# Altium project 1st_desing.PrjPcb (part 1 of 2)
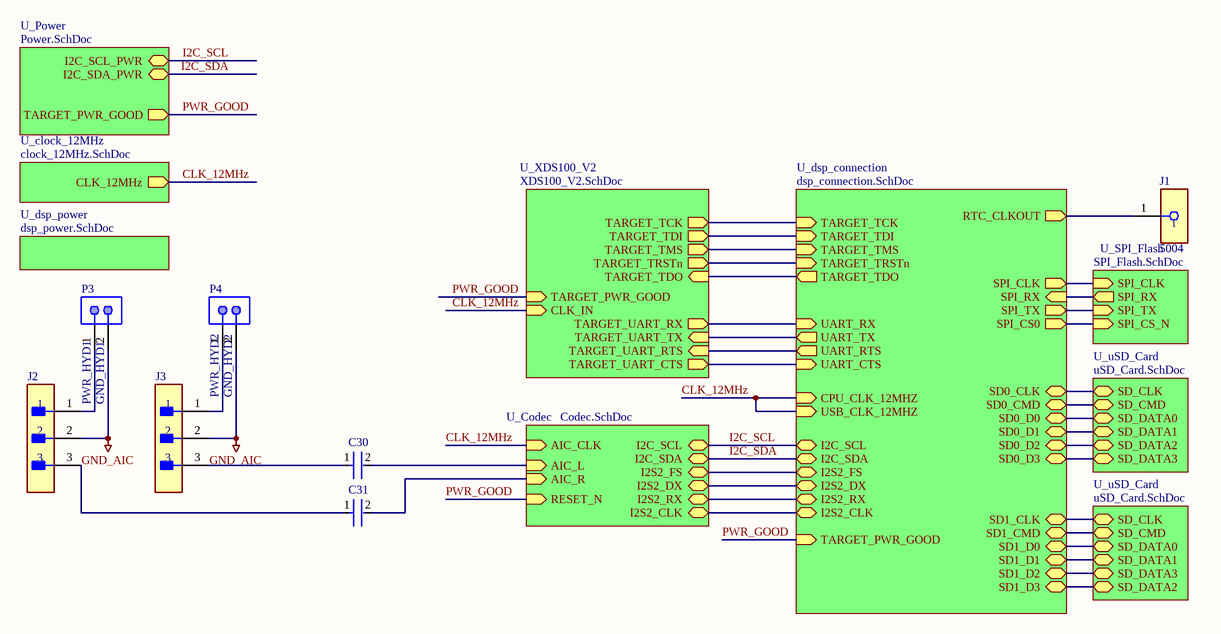
[diagram p0: SAMARUC.SchDoc]
9 sheets, 203 parts. Net scope: hierarchical (ports join the sheet entries above them; power ports are global).
Board file: PCB_SAMARUC.PcbDoc
Sheets:
  SAMARUC.SchDoc
    U_Codec = Codec.SchDoc
    U_SPI_Flash = SPI_Flash.SchDoc
    U_uSD_Card = uSD_Card.SchDoc
    U_clock_12MHz = clock_12MHz.SchDoc
    U_dsp_connection = dsp_connection.SchDoc
    U_XDS100_V2 = XDS100_V2.SchDoc
    U_dsp_power = dsp_power.SchDoc
    U_uSD_Card = uSD_Card.SchDoc
    U_Power = Power.SchDoc

## Sheet SAMARUC.SchDoc
size A4; SheetNumber: 1; SheetTotal: 9

### Parts
C30  RCER71H106MWK1H03B  [FP-RCEWM1-MFG]  (value not drawn)
C31  RCER71H106MWK1H03B  [FP-RCEWM1-MFG]  (value not drawn)
J1  5004  [FP-5004-MFG]
J2  22-11-2032  [FP-22-11-2032-MFG]  (value not drawn)
J3  22-11-2032  [FP-22-11-2032-MFG]  (value not drawn)
P3  22-23-2021  [MOLX-22-23-2021_V]  (value not drawn)
P4  22-23-2021  [MOLX-22-23-2021_V]  (value not drawn)

### Sub-sheets
U_clock_12MHz = clock_12MHz.SchDoc: CLK_12MHz (out)
U_Codec = Codec.SchDoc: I2C_SCL (bidir), I2C_SDA (bidir), I2S2_FS (bidir), I2S2_DX (bidir), I2S2_RX (bidir), I2S2_CLK (bidir), RESET_N (in), AIC_L (in), AIC_R (in), AIC_CLK (in)
U_dsp_connection = dsp_connection.SchDoc: TARGET_TCK (in), TARGET_TDI (in), TARGET_TDO (out), TARGET_TMS (in), TARGET_TRSTn (in), I2C_SCL (bidir), I2C_SDA (bidir), I2S2_FS (bidir), I2S2_DX (bidir), I2S2_RX (bidir), I2S2_CLK (bidir), USB_CLK_12MHZ (in), RTC_CLKOUT (out), CPU_CLK_12MHZ (in), SD0_D0 (bidir), SD1_D1 (bidir), UART_RX (in), UART_TX (out), SD0_D1 (bidir), UART_RTS (out), SD1_CMD (bidir), SD0_D3 (bidir), SD0_CMD (bidir), SPI_CLK (out), SD1_CLK (bidir), SD1_D0 (bidir), UART_CTS (in), SPI_TX (out), SD0_D2 (bidir), SPI_RX (in), SD1_D2 (bidir), SPI_CS0 (out), SD0_CLK (bidir), SD1_D3 (bidir), TARGET_PWR_GOOD (in)
U_dsp_power = dsp_power.SchDoc: no entries
U_Power = Power.SchDoc: TARGET_PWR_GOOD (out), I2C_SCL_PWR (bidir), I2C_SDA_PWR (bidir)
U_SPI_Flash = SPI_Flash.SchDoc: SPI_CLK (in), SPI_TX (in), SPI_CS_N (in), SPI_RX (out)
U_uSD_Card = uSD_Card.SchDoc: SD_DATA2 (bidir), SD_DATA3 (bidir), SD_CMD (bidir), SD_CLK (bidir), SD_DATA0 (bidir), SD_DATA1 (bidir)
U_uSD_Card = uSD_Card.SchDoc: SD_DATA2 (bidir), SD_DATA3 (bidir), SD_CMD (bidir), SD_CLK (bidir), SD_DATA0 (bidir), SD_DATA1 (bidir)
U_XDS100_V2 = XDS100_V2.SchDoc: CLK_IN (in), TARGET_TCK (out), TARGET_TDI (out), TARGET_TDO (in), TARGET_TMS (out), TARGET_TRSTn (out), TARGET_PWR_GOOD (in), TARGET_UART_TX (in), TARGET_UART_RX (out), TARGET_UART_CTS (out), TARGET_UART_RTS (in)

### Nets
GND_AIC: J2.2 J3.2 P3.2 P4.2
CLK_12MHz: sheet U_Codec/AIC_CLK, sheet U_clock_12MHz/CLK_12MHz, sheet U_dsp_connection/USB_CLK_12MHZ, sheet U_dsp_connection/CPU_CLK_12MHZ, sheet U_XDS100_V2/CLK_IN
I2C_SCL: sheet U_Codec/I2C_SCL, sheet U_dsp_connection/I2C_SCL, sheet U_Power/I2C_SCL_PWR
I2C_SDA: sheet U_Codec/I2C_SDA, sheet U_dsp_connection/I2C_SDA, sheet U_Power/I2C_SDA_PWR
PWR_GOOD: sheet U_Codec/RESET_N, sheet U_dsp_connection/TARGET_PWR_GOOD, sheet U_XDS100_V2/TARGET_PWR_GOOD, sheet U_Power/TARGET_PWR_GOOD
NetC5_2: C30.2 ; sheet U_Codec/AIC_L
NetC6_2: C31.2 ; sheet U_Codec/AIC_R
NetC30_1: C30.1 J3.3
NetC31_1: C31.1 J2.3
NetIC1_A3: J1.1 ; sheet U_dsp_connection/RTC_CLKOUT
NetIC1_J1: sheet U_dsp_connection/SD0_D0, sheet U_uSD_Card/SD_DATA0
NetIC1_K1: sheet U_SPI_Flash/SPI_TX, sheet U_dsp_connection/SPI_TX
NetIC1_K2: sheet U_dsp_connection/TARGET_TDI, sheet U_XDS100_V2/TARGET_TDI
NetIC1_L1: sheet U_SPI_Flash/SPI_CS_N, sheet U_dsp_connection/SPI_CS0
NetIC1_L3: sheet U_SPI_Flash/SPI_CLK, sheet U_dsp_connection/SPI_CLK
NetIC1_L11: sheet U_uSD_Card/SD_CMD, sheet U_dsp_connection/SD1_CMD
NetIC1_L12: sheet U_uSD_Card/SD_DATA3, sheet U_dsp_connection/SD1_D2
NetIC1_M8: sheet U_dsp_connection/SD0_CLK, sheet U_uSD_Card/SD_CLK
NetIC1_M10: sheet U_dsp_connection/SD0_CMD, sheet U_uSD_Card/SD_CMD
NetIC1_M11: sheet U_dsp_connection/UART_TX, sheet U_XDS100_V2/TARGET_UART_TX
NetIC1_M12: sheet U_uSD_Card/SD_DATA2, sheet U_dsp_connection/SD1_D3
NetIC1_M13: sheet U_uSD_Card/SD_DATA0, sheet U_dsp_connection/SD1_D0
NetIC1_M14: sheet U_uSD_Card/SD_CLK, sheet U_dsp_connection/SD1_CLK
NetIC1_N1: sheet U_dsp_connection/TARGET_TDO, sheet U_XDS100_V2/TARGET_TDO
NetIC1_N3: sheet U_dsp_connection/TARGET_TCK, sheet U_XDS100_V2/TARGET_TCK
NetIC1_N4: sheet U_SPI_Flash/SPI_RX, sheet U_dsp_connection/SPI_RX
NetIC1_N6: sheet U_dsp_connection/TARGET_TMS, sheet U_XDS100_V2/TARGET_TMS
NetIC1_N10: sheet U_Codec/I2S2_FS, sheet U_dsp_connection/I2S2_FS
NetIC1_N12: sheet U_dsp_connection/UART_RTS, sheet U_XDS100_V2/TARGET_UART_RTS
NetIC1_N13: sheet U_dsp_connection/SD0_D2, sheet U_uSD_Card/SD_DATA2
NetIC1_P4: sheet U_dsp_connection/TARGET_TRSTn, sheet U_XDS100_V2/TARGET_TRSTn
NetIC1_P5: sheet U_Codec/I2S2_CLK, sheet U_dsp_connection/I2S2_CLK
NetIC1_P6: sheet U_dsp_connection/SD0_D1, sheet U_uSD_Card/SD_DATA1
NetIC1_P7: sheet U_dsp_connection/SD0_D3, sheet U_uSD_Card/SD_DATA3
NetIC1_P9: sheet U_Codec/I2S2_RX, sheet U_dsp_connection/I2S2_RX
NetIC1_P10: sheet U_uSD_Card/SD_DATA1, sheet U_dsp_connection/SD1_D1
NetIC1_P11: sheet U_Codec/I2S2_DX, sheet U_dsp_connection/I2S2_DX
NetIC1_P12: sheet U_dsp_connection/UART_CTS, sheet U_XDS100_V2/TARGET_UART_CTS
NetIC1_P13: sheet U_dsp_connection/UART_RX, sheet U_XDS100_V2/TARGET_UART_RX
NetJ2_1: J2.1 P3.1
NetJ3_1: J3.1 P4.1

### Notes on the sheet
- PWR_HYD1
- GND_HYD1
- PWR_HYD2
- (near P4) GND_HYD2

### Library data of the parts
C30 C31 = CMP-06035-035073-1: Cap Ceramic 10uF 50V X7R ±20% Radial 5mm +125°C Automotive Ammo Pack; Lead/Base Style: Formed Leads; Lead Diameter: 0.5mm; Width: 4mm; Max Operating Temperature: 125°C; Case/Package: Radial; Capacitance: 10uF; Mount: Through Hole; Depth: 7.5mm; Dielectric: X7R; Tolerance: 20%; Length: 5.5mm; Min Operating Temperature: -55°C; Height: 7.5mm; Ratings: AEC-Q200; Voltage Rating: 50V; Lead Pitch: 0.197inch; Diameter: 5.5mm; Height - Seated (Max): 0.295inch; Voltage: 50V; Resistor Type: Ceramic; Voltage Rating (DC): 50V; Package Quantity: 500; Lead Free: Lead Free; Packaging: Bulk; Termination: Radial
J1 = CMP-2000-05575-2: PC TEST POINT MINIATURE YELLOW; Manufacturer: Keystone; Number Of Contacts: 1; Is Female: yes; Device Class L1: Connectors; Manufacturer Part Number: 5004; Digikey Description: PC TEST POINT MINIATURE YELLOW; ComponentLink2URL: https://www.keyelco.com/product-pdf.cfm?p=1313; Lead Free: Yes; ComponentLink2Description: Datasheet; Category: Conn; Height: 4.72mm; Octopart: https://octopart.com/5004-keystone-28591; Mouser Description: TEST POINT PC MINI .040"D YELLOW; Device Class L3: unset; Contact Material: Silver; Package: 5004; Automotive: No; Device Class L2: unset; RoHS: TRUE
J2 J3 = CMP-04776-000113-1: CONN HEADER VERT 3POS 2.54MM; Manufacturer: Molex; Number Of Contacts: 3; Voltage Rating: 500V; Conn Gender: Male; Current Rating: 4A; Conn Orientation: Vertical; Device Class L2: Headers and Wire Housings; Number Of Rows: 1; Temperature Range High: +80°C; RoHS: TRUE; ComponentLink2URL: https://www.molex.com/webdocs/datasheets/pdf/en-us/0022112032_PCB_HEADERS.pdf; Manufacturer Part Number: 22-11-2032; Device Class L3: unset; Automotive: No; Temperature: -40°C to +80°C; Temperature Range Low: -40°C; Lead Free: Yes; Pitch: 2.54mm; Footprint Url: https://www.molex.com/pdm_docs/sd/022112032_sd.pdf; Digikey Description: CONN HEADER VERT 3POS 2.54MM; Contact Material: Gold,Nickel; Octopart: https://octopart.com/22-11-2032-molex-10085; Height: 10.91mm; Mouser Description: KK® 254 Solid Header, Vertical, with Friction Lock, 3 Circuits, Gold (Au) Plating; Package: 22-11-2032; Device Class L1: Connectors; Mounting Type: Through Hole; ComponentLink2Description: Datasheet; Category: Conn
P3 P4 = CMP-1704-00001-3: Male Header, Pitch 2.54 mm, 1 x 2 Position, Height 10.67 mm, Tail Length 3.56 mm, 0 to 75 degC, RoHS, Bulk; Package Quantity: 3000; Height: 10.67 mm; RoHSCompliant: True; ComponentLink2URL: https://datasheet.ciiva.com/19454/232266-19454304.pdf; PartNumber: 22-23-2021; Packaging: Bulk; ComponentLink2Description: Datasheet; Min Operating Temperature: 0 degC; ComponentLink1Description: Manufacturer URL; Length: 5.08 mm; Mounting Technology: Through Hole; Max Operating Temperature: 75 degC; REACH SVHC: Unknown; PackageDescription: Male Header, Pitch 2.54 mm, 1 x 2 Position, Height 10.67 mm, Tail Length 3.56 mm; ComponentLink1URL: http://www.molex.com/; Mount: Through Hole; Radiation Hardening: No; Width: 6.35 mm; Pins: 2

## Sheet Codec.SchDoc
size A4; SheetNumber: 2; SheetTotal: 9
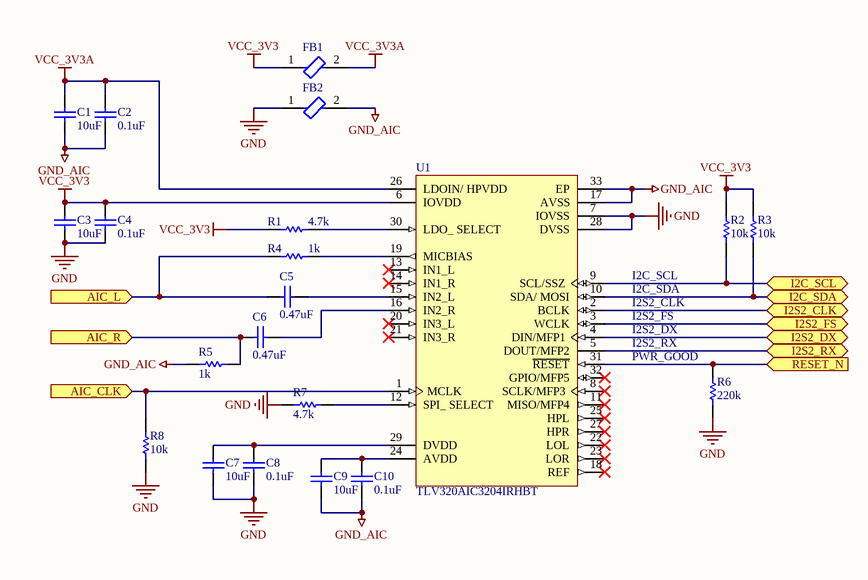
[diagram p1: Codec.SchDoc]

### Parts
C1  10uF  [0805_C_S]
C2  0.1uF  [0805_C_S]
C3  10uF  [0805_C_S]
C4  0.1uF  [0805_C_S]
C5  0.47uF  [0805_C_S]
C6  0.47uF  [0805_C_S]
C7  10uF  [0805_C_S]
C8  0.1uF  [0805_C_S]
C9  10uF  [0805_C_S]
C10  0.1uF  [0805_C_S]
FB1  BLM21AG151SN1D  [FP-BLM21-0_2-t0_85-e0_5-MFG]  (value not drawn)
FB2  BLM21AG151SN1D  [FP-BLM21-0_2-t0_85-e0_5-MFG]  (value not drawn)
R1  4.7k  [0805_R_S]
R2  10k  [0805_R_S]
R3  10k  [0805_R_S]
R4  1k  [0805_R_S]
R5  1k  [0805_R_S]
R6  220k  [0805_R_S]
R7  4.7k  [0805_R_S]
R8  10k  [0805_R_S]
U1  TLV320AIC3204IRHBT  [RHB0032E_V]

### Ports
AIC_CLK (in), AIC_L (in), AIC_R (in), I2C_SCL (bidir), I2C_SDA (bidir), I2S2_CLK (bidir), I2S2_DX (bidir), I2S2_FS (bidir), I2S2_RX (bidir), RESET_N (in)

### Nets
GND: C3.1 C4.1 C7.1 C8.1 FB2.1 R6.1 R7.1 R8.1 U1.7(IOVSS) U1.28(DVSS)
GND_AIC: C1.1 C2.1 C9.1 C10.1 FB2.2 R5.2 U1.17(AVSS) U1.33(EP)
VCC_3V3: C3.2 C4.2 FB1.1 R1.2 R2.2 R3.2 U1.6(IOVDD)
VCC_3V3A: C1.2 C2.2 FB1.2 U1.26(LDOIN/_HPVDD)
CLK_12MHz: R8.2 U1.1(MCLK) ; port AIC_CLK
I2C_SCL: R2.1 U1.9(SCL/SSZ) ; port I2C_SCL
I2C_SDA: R3.1 U1.10(SDA/_MOSI) ; port I2C_SDA
PWR_GOOD: R6.2 U1.31(~{RESET}) ; port RESET_N
NetC5_1: C5.1 U1.15(IN2_L)
NetC5_2: C5.2 R4.2 ; port AIC_L
NetC6_1: C6.1 U1.16(IN2_R)
NetC6_2: C6.2 R5.1 ; port AIC_R
NetC7_2: C7.2 C8.2 U1.29(DVDD)
NetC9_2: C9.2 C10.2 U1.24(AVDD)
NetIC1_N10: U1.3(WCLK) ; port I2S2_FS
NetIC1_P5: U1.2(BCLK) ; port I2S2_CLK
NetIC1_P9: U1.5(DOUT/MFP2) ; port I2S2_RX
NetIC1_P11: U1.4(DIN/MFP1) ; port I2S2_DX
NetR1_1: R1.1 U1.30(LDO__SELECT)
NetR4_1: R4.1 U1.19(MICBIAS)
NetR7_2: R7.2 U1.12(SPI__SELECT)

Not connected (* = marked no-connect by the designer): U1 8(SCLK/MFP3)* 11(MISO/MFP4)* 13(IN1_L)* 14(IN1_R)* 18(REF)* 20(IN3_L)* 21(IN3_R)* 22(LOL)* 23(LOR)* 25(HPL)* 27(HPR)* 32(GPIO/MFP5)*

### Notes on the sheet
- I2C_SCL
- I2C_SDA
- I2S2_CLK
- I2S2_FS
- PWR_GOOD
- I2S2_DX
- I2S2_RX

### Library data of the parts
C1-C10 = Cap: Capacitor; Published: 8-Jun-2000; LatestRevisionDate: 17-Jul-2002; LatestRevisionNote: Re-released for DXP Platform.; Publisher: Altium Limited
  C1 C3 C7 C9: Value: 10uF
  C2 C4 C8 C10: Value: 0.1uF
  C5 C6: Value: 0.47uF
FB1 FB2 = CMP-0686-00717-3: Chip Ferrite Bead, 0805, 150Ω @ 100MHz, 0.09Ω, 25%, 1A; Number of Circuits: 1; Max Current Rating: 800mA; DC Resistance (DCR): 100mR; Shielding: Unshielded; DC Current: 200mA; Impedance: 150R; Contact Plating: Tin; Weight: 0.000194oz; Series: EMIFIL®, BLM21A; Core Material: Ferrite; Test Frequency: 100MHz; Case Code (Metric): 2012; Package Quantity: 4000; Lead Free: Lead Free; Max Operating Temperature: 125°C; Case Code (Imperial): 0805; Material: Ferrite; Min Operating Temperature: -55°C; Tolerance: 25%; Length: 2mm; DC Resistance-Max: 100mR; Width: 1.25mm; RoHS Compliant: Yes; Packaging: Tape and Reel; REACH SVHC: No SVHC; Depth: 1.45mm; Number of Pins: 2; Radiation Hardening: No; Current Rating: 800mA; Height: 0.85mm; Termination: SMD/SMT; Number of Lines: 1; Max DC Current: 200mA; Case/Package: 0805
R1-R8 = Res1: Resistor; Published: 8-Jun-2000; LatestRevisionDate: 17-Jul-2002; LatestRevisionNote: Re-released for DXP Platform.; Publisher: Altium Limited
  R1 R7: Value: 4.7k
  R2 R3 R8: Value: 10k
  R4 R5: Value: 1k
  R6: Value: 220k
U1 = CMP-0331-00080-2: Very Low-Power Stereo Audio CODEC with Power Tune? Technology, 2 ADCs and 2 DACs, 100 dB DAC SNR, -40 to 85 degC, 32-pin QFN (RHB), Green (RoHS & no Sb/Br); Manufacturer: Texas Instruments; Digital Audio Interfaces: L, R, I2S, TDM, DSP; Sampling Rate (Max) (kHz): 192; DAC SNR: 100; # DACs: 2; Battery Powered: TRUE; Additional Features: PowerTune (tm), Processing blocks for digital audio effects, LP Bypass, PLL, Digital Mic Support, LDO; Control Interface: SPI, I2C; PartNumber: TLV320AIC3204IRHBT; Mounting Technology: Surface Mount; DatasheetVersion: SLOS602A; ComponentLink1URL: http://www.ti.com/general/docs/lit/getliterature.tsp?genericPartNumber=TLV320AIC3204&fileType=pdf; PackageDescription: 32-Pin Plastic Quad Flat No-Lead, 5 x 5 mm Body, 0.5 mm Pitch, 3.45 x 3.45 mm Exposed Pad; PackageReference: RHB0032E; PackageVersion: revD, Jun-2011; ComponentLink1Description: Datasheet; Code_JEDEC: MO-220; # ADCs (typ): 2

## Sheet SPI_Flash.SchDoc
size A4; SheetNumber: 3; SheetTotal: 10
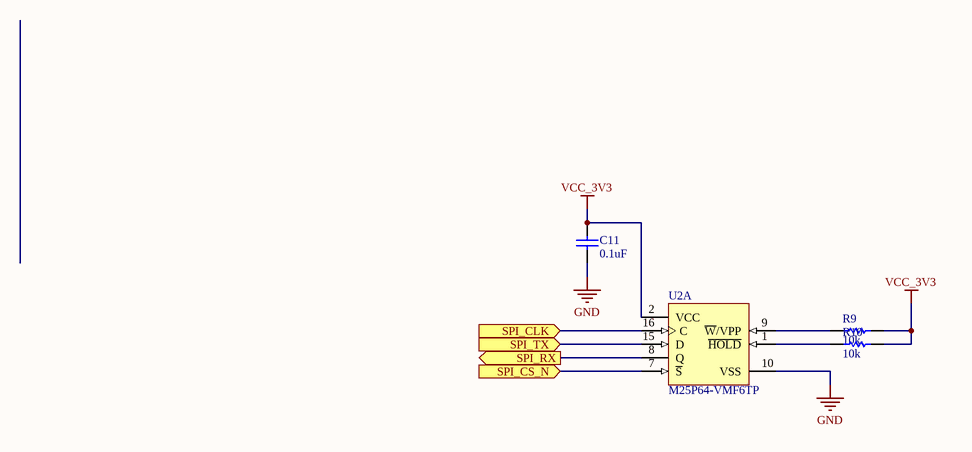
[diagram p2: SPI_Flash.SchDoc]

### Parts
C11  0.1uF  [0805_C_S]
R9  10k  [0805_R_S]
R10  10k  [0805_R_S]
U2  M25P64-VMF6TP  [MICT-MF-16_N]  (part A of 2)

### Ports
SPI_CLK (in), SPI_CS_N (in), SPI_RX (out), SPI_TX (in)

### Nets
GND: C11.1 U2.10(VSS)
VCC_3V3: C11.2 R9.1 R10.1 U2.2(VCC)
NetIC1_K1: U2.15(D) ; port SPI_TX
NetIC1_L1: U2.7(~{S}) ; port SPI_CS_N
NetIC1_L3: U2.16(C) ; port SPI_CLK
NetIC1_N4: U2.8(Q) ; port SPI_RX
NetR9_2: R9.2 U2.9(~{W}/VPP)
NetR10_2: R10.2 U2.1(~{HOLD})

### Library data of the parts
C11 = Cap: Capacitor; Published: 8-Jun-2000; LatestRevisionDate: 17-Jul-2002; LatestRevisionNote: Re-released for DXP Platform.; Publisher: Altium Limited; Value: 0.1uF
R9 R10 = Res1: Resistor; Published: 8-Jun-2000; LatestRevisionDate: 17-Jul-2002; LatestRevisionNote: Re-released for DXP Platform.; Publisher: Altium Limited; Value: 10k
U2 = CMP-0357-00029-1: 64 Mb (x1) Serial NOR Flash Memory, 75 MHz, 2.7 to 3.6 V, 16-pin SO16 Wide (MF), Tape & Reel; Manufacturer: Micron; Part Family: M25PÂ; Density: 64MbÂ; Speed: 75 MHzÂ; Voltage: 2.7V-3.6VÂ; PackageVersion: Rev. A; ComponentLink1Description: Manufacturer URL; PartNumber: M25P64-VMF6TP; Package: SO16 WideÂ; Applications: EmbeddedÂ; PackageDescription: 16-Pin SO Wide, 7.5 X 10.3 mm, Pitch 1.27 mm; ComponentLink1URL: http://www.micron.com/; Mounting Technology: Surface Mount; Part Status: ProductionÂ; Width: x1Â; ComponentLink3Description: Package Specification; DatasheetVersion: Rev. 12; Type: Data StorageÂ; ComponentLink3URL: http://www.micron.com/~/media/Documents/Products/Data%20Sheet/NOR%20Flash/Serial%20NOR/M25P/M25P128.pdf; RoHS: YesÂ; ComponentLink2URL: http://www.micron.com/~/media/Documents/Products/Data%20Sheet/NOR%20Flash/Serial%20NOR/M25P/M25P64.pdf; PackageReference: MICT-MF-16; ComponentLink2Description: Datasheet

## Sheet uSD_Card.SchDoc
size A4; SheetNumber: 4; SheetTotal: 10
Used 2 times, as channels U_uSD_Card, U_uSD_Card. Parts and nets are listed once, with the designators drawn on the sheet.
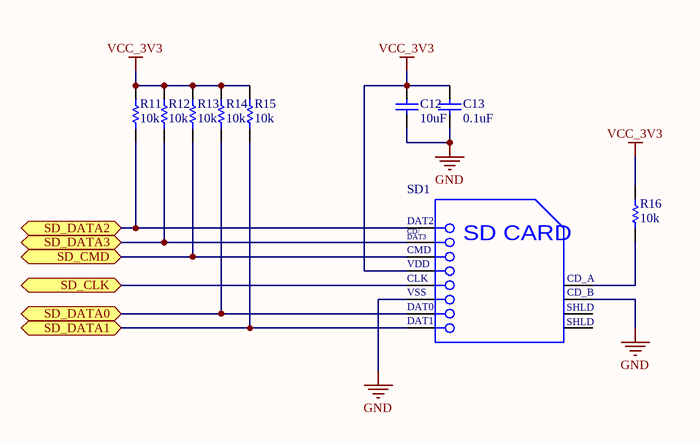
[diagram p3: uSD_Card.SchDoc]

### Parts
C12  10uF  [0805_C_S]
C13  0.1uF  [0805_C_S]
R11  10k  [0805_R_S]
R12  10k  [0805_R_S]
R13  10k  [0805_R_S]
R14  10k  [0805_R_S]
R15  10k  [0805_R_S]
R16  10k  [0805_R_S]
SD1  104031-0811  [MOLX-104031-0811_V]  (value not drawn)

### Ports
SD_CLK (bidir), SD_CMD (bidir), SD_DATA0 (bidir), SD_DATA1 (bidir), SD_DATA2 (bidir), SD_DATA3 (bidir)

### Nets
GND: C12.1 C13.1 SD1.6(VSS2) SD1.10(CD_B)
VCC_3V3: C12.2 C13.2 R11.1 R12.1 R13.1 R14.1 R15.1 R16.1 SD1.4(VDD)
SD_CLK: SD1.5(CLK) ; port SD_CLK
SD_CMD: R13.2 SD1.3(VSS1) ; port SD_CMD
SD_DATA0: R14.2 SD1.7(DAT0) ; port SD_DATA0
SD_DATA1: R15.2 SD1.8(DAT1) ; port SD_DATA1
SD_DATA2: R11.2 SD1.1(CD/DAT3) ; port SD_DATA2
SD_DATA3: R12.2 SD1.2(CMD) ; port SD_DATA3
NetR16_2: R16.2 SD1.9(CD_A)

Not connected (* = marked no-connect by the designer): SD1 11(SHLD1) 12(SHLD2)

### Channels
U_uSD_Card: designators end in _U_uSD_Card#1; ports SD_CLK=NetIC1_M14 SD_CMD=NetIC1_L11 SD_DATA0=NetIC1_M13 SD_DATA1=NetIC1_P10 SD_DATA2=NetIC1_M12 SD_DATA3=NetIC1_L12
U_uSD_Card: designators end in _U_uSD_Card#2; ports SD_CLK=NetIC1_M8 SD_CMD=NetIC1_M10 SD_DATA0=NetIC1_J1 SD_DATA1=NetIC1_P6 SD_DATA2=NetIC1_N13 SD_DATA3=NetIC1_P7

### Notes on the sheet
- (in symbol CMP-2000-05825-1) DAT2; CD/; DAT3; SD CARD; VSS; SHLD

### Library data of the parts
C12 C13 = Cap: Capacitor; Published: 8-Jun-2000; LatestRevisionDate: 17-Jul-2002; LatestRevisionNote: Re-released for DXP Platform.; Publisher: Altium Limited
  C12: Value: 10uF
  C13: Value: 0.1uF
R11-R16 = Res1: Resistor; Published: 8-Jun-2000; LatestRevisionDate: 17-Jul-2002; LatestRevisionNote: Re-released for DXP Platform.; Publisher: Altium Limited; Value: 10k
SD1 = CMP-2000-05825-1: Micro SD Card, RA, -25 to 85 degC, 8-Pin SMD, RoHS, Tape and Reel; Voltage Rating: 10VAC/DC; Number of Contacts: 8; Insertion - Extraction Style: Push-Pull; Pitch: 1.1mm; Mating Cycles: 10000; Brand: Molex; Current Rating: 500mA; Manufacturer URL: http://www.molex.com/; Card Type: microSD; Mounting Type: Standard; Height: 1.42mm; Mounting Technology: SurfaceMount; Contact Plating: Gold; Product Category: MemoryCardConnectors; Package Description: 8-Pin Surface Mount Device, Body 11.95 x 11.4 mm, Pitch 1.1 mm; Datasheet URL: http://www.molex.com/pdm_docs/sd/1040310811_sd.pdf; Termination Style: SMD; Length: 11.4mm; Housing Material: LiquidCrystalPolymer(LCP); Orientation: RightAngle; RoHS: True; Contact Material: PhosphorBronze; Datasheet Version: Rev. E, 04/2006; Packaging: Reel; Manufacturer: Molex; Series: 104031; Product: CardConnectors; Number of Rows: 1Row; Package Reference: 104031-0811

## Sheet clock_12MHz.SchDoc
size A4; SheetNumber: 8; SheetTotal: 10
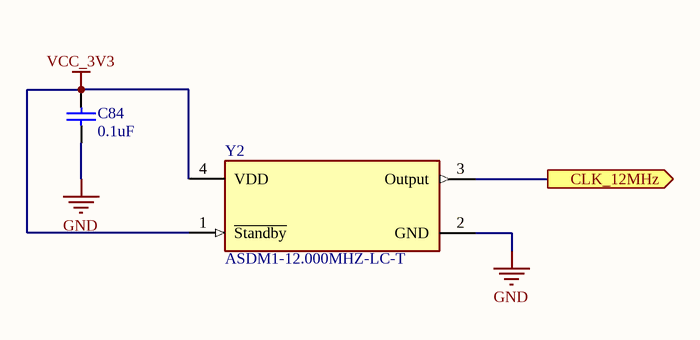
[diagram p4: clock_12MHz.SchDoc]

### Parts
C84  0.1uF  [0805_C_S]
Y2  ASDM1-12.000MHZ-LC-T  [FP-ASDM-ASDMB-MFG]

### Ports
CLK_12MHz (out)

### Nets
GND: C84.1 Y2.2(GND)
VCC_3V3: C84.2 Y2.1(~{Standby}) Y2.4(VDD)
CLK_12MHz: Y2.3(Output) ; port CLK_12MHz

### Library data of the parts
C84 = Cap: Capacitor; Published: 8-Jun-2000; LatestRevisionDate: 17-Jul-2002; LatestRevisionNote: Re-released for DXP Platform.; Publisher: Altium Limited; Value: 0.1uF
Y2 = CMP-27762-002611-1: MEMS Oscillator 12MHz ±50ppm LVCMOS 3.3V SMD 2.5x2mm; Load Capacitance: 15pF; Min Supply Voltage: 3V; Max Supply Voltage: 3.6V; Max Supply Current: 10mA; Length: 0.098inch; Operating Supply Voltage: 3.3V; Number of Pins: 4; Packaging: Tape and Reel; Height: 0.035inch; Width: 0.079inch; Mount: Surface Mount; Case/Package: SMD/SMT; Series: Pure Silicon™ ASDM; Lead Free: Lead Free; Frequency: 12MHz; Max Operating Temperature: 85°C; RoHS Compliant: Yes; Package Quantity: 1000; Min Operating Temperature: -40°C; Operating Frequency: 12 MHz; Termination: SMD/SMT; Frequency Stability: 50ppm

## Sheet dsp_connection.SchDoc
size A4; SheetNumber: 6; SheetTotal: 9
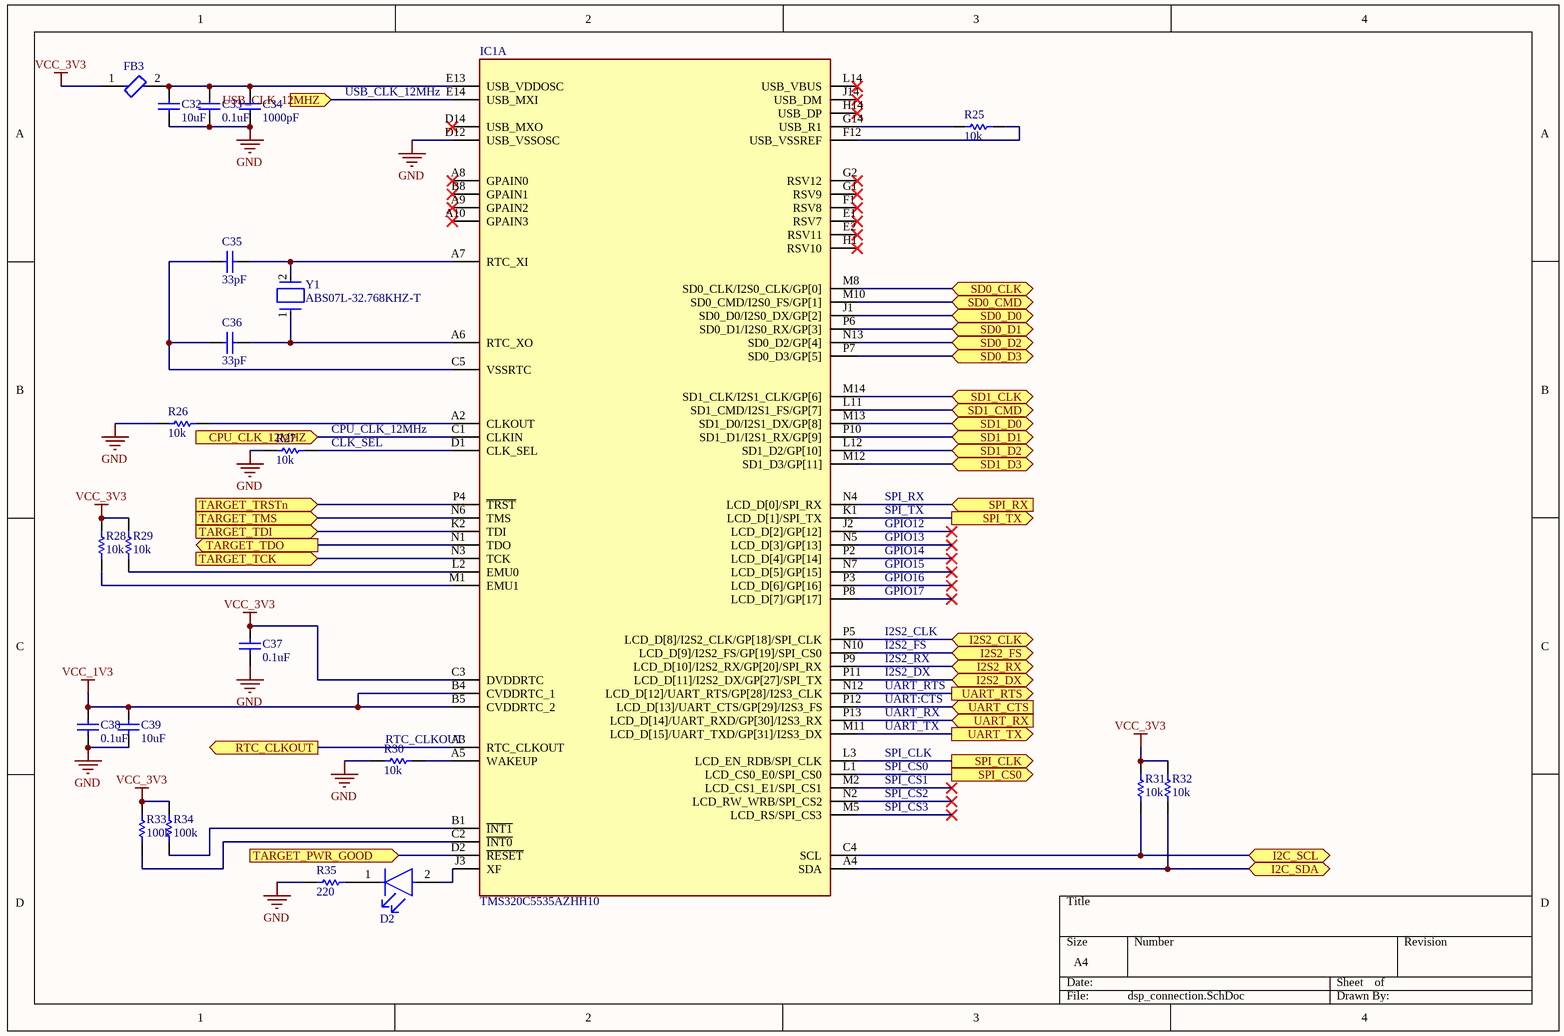
[diagram p5: dsp_connection.SchDoc]

### Parts
C32  10uF  [0805_C_S]
C33  0.1uF  [0805_C_S]
C34  1000pF  [0805_C_S]
C35  33pF  [0805_C_S]
C36  33pF  [0805_C_S]
C37  0.1uF  [0805_C_S]
C38  0.1uF  [0805_C_S]
C39  10uF  [0805_C_S]
D2  LTST-C150AKT  [FP-LTST-C150AKT-MFG]  (value not drawn)
FB3  BLM21AG151SN1D  [FP-BLM21-0_2-t0_85-e0_5-MFG]  (value not drawn)
IC1  TMS320C5535AZHH10  [BGA144C80P14X14_1200X1200X140]  (part A of 2)
R25  10k  [0805_R_S]
R26  10k  [0805_R_S]
R27  10k  [0805_R_S]
R28  10k  [0805_R_S]
R29  10k  [0805_R_S]
R30  10k  [0805_R_S]
R31  10k  [0805_R_S]
R32  10k  [0805_R_S]
R33  100k  [0805_R_S]
R34  100k  [0805_R_S]
R35  220  [0805_R_S]
Y1  ABS07L-32.768KHZ-T  [FP-ABS07L-MFG]

### Ports
CPU_CLK_12MHZ (in), I2C_SCL (bidir), I2C_SDA (bidir), I2S2_CLK (bidir), I2S2_DX (bidir), I2S2_FS (bidir), I2S2_RX (bidir), RTC_CLKOUT (out), SD0_CLK (bidir), SD0_CMD (bidir), SD0_D0 (bidir), SD0_D1 (bidir), SD0_D2 (bidir), SD0_D3 (bidir), SD1_CLK (bidir), SD1_CMD (bidir), SD1_D0 (bidir), SD1_D1 (bidir), SD1_D2 (bidir), SD1_D3 (bidir), SPI_CLK (out), SPI_CS0 (out), SPI_RX (in), SPI_TX (out), TARGET_PWR_GOOD (in), TARGET_TCK (in), TARGET_TDI (in), TARGET_TDO (out), TARGET_TMS (in), TARGET_TRSTn (in), UART_CTS (in), UART_RTS (out), UART_RX (in), UART_TX (out), USB_CLK_12MHZ (in)

### Nets
GND: C32.1 C33.1 C34.1 C37.1 C38.1 C39.1 IC1.D12(USB_VSSOSC) R26.1 R27.1 R30.1 R35.2
VCC_1V3: C38.2 C39.2 IC1.B4(CVDDRTC_1) IC1.B5(CVDDRTC_2)
VCC_3V3: C37.2 FB3.1 IC1.C3(DVDDRTC) R28.1 R29.1 R31.1 R32.1 R33.1 R34.1
CLK_12MHz: IC1.C1(CLKIN) IC1.E14(USB_MXI) ; port CPU_CLK_12MHZ, port USB_CLK_12MHZ
I2C_SCL: IC1.C4(SCL) R31.2 ; port I2C_SCL
I2C_SDA: IC1.A4(SDA) R32.2 ; port I2C_SDA
PWR_GOOD: IC1.D2(~{RESET}) ; port TARGET_PWR_GOOD
NetC32_2: C32.2 C33.2 C34.2 FB3.2 IC1.E13(USB_VDDOSC)
NetC35_1: C35.1 C36.1 IC1.C5(VSSRTC)
NetC35_2: C35.2 IC1.A7(RTC_XI) Y1.2
NetC36_2: C36.2 IC1.A6(RTC_XO) Y1.1
NetD2_1: D2.1(C) R35.1
NetD2_2: D2.2(A) IC1.J3(XF)
NetIC1_A2: IC1.A2(CLKOUT) R26.2
NetIC1_A3: IC1.A3(RTC_CLKOUT) ; port RTC_CLKOUT
NetIC1_A5: IC1.A5(WAKEUP) R30.2
NetIC1_B1: IC1.B1(~{INT1}) R34.2
NetIC1_C2: IC1.C2(~{INT0}) R33.2
NetIC1_D1: IC1.D1(CLK_SEL) R27.2
NetIC1_F12: IC1.F12(USB_VSSREF) R25.2
NetIC1_G14: IC1.G14(USB_R1) R25.1
NetIC1_J1: IC1.J1(SD0_D0/I2S0_DX/GP[2]) ; port SD0_D0
NetIC1_K1: IC1.K1(LCD_D[1]/SPI_TX) ; port SPI_TX
NetIC1_K2: IC1.K2(TDI) ; port TARGET_TDI
NetIC1_L1: IC1.L1(LCD_CS0_E0/SPI_CS0) ; port SPI_CS0
NetIC1_L2: IC1.L2(EMU0) R29.2
NetIC1_L3: IC1.L3(LCD_EN_RDB/SPI_CLK) ; port SPI_CLK
NetIC1_L11: IC1.L11(SD1_CMD/I2S1_FS/GP[7]) ; port SD1_CMD
NetIC1_L12: IC1.L12(SD1_D2/GP[10]) ; port SD1_D2
NetIC1_M1: IC1.M1(EMU1) R28.2
NetIC1_M8: IC1.M8(SD0_CLK/I2S0_CLK/GP[0]) ; port SD0_CLK
NetIC1_M10: IC1.M10(SD0_CMD/I2S0_FS/GP[1]) ; port SD0_CMD
NetIC1_M11: IC1.M11(LCD_D[15]/UART_TXD/GP[31]/I2S3_DX) ; port UART_TX
NetIC1_M12: IC1.M12(SD1_D3/GP[11]) ; port SD1_D3
NetIC1_M13: IC1.M13(SD1_D0/I2S1_DX/GP[8]) ; port SD1_D0
NetIC1_M14: IC1.M14(SD1_CLK/I2S1_CLK/GP[6]) ; port SD1_CLK
NetIC1_N1: IC1.N1(TDO) ; port TARGET_TDO
NetIC1_N3: IC1.N3(TCK) ; port TARGET_TCK
NetIC1_N4: IC1.N4(LCD_D[0]/SPI_RX) ; port SPI_RX
NetIC1_N6: IC1.N6(TMS) ; port TARGET_TMS
NetIC1_N10: IC1.N10(LCD_D[9]/I2S2_FS/GP[19]/SPI_CS0) ; port I2S2_FS
NetIC1_N12: IC1.N12(LCD_D[12]/UART_RTS/GP[28]/I2S3_CLK) ; port UART_RTS
NetIC1_N13: IC1.N13(SD0_D2/GP[4]) ; port SD0_D2
NetIC1_P4: IC1.P4(~{TRST}) ; port TARGET_TRSTn
NetIC1_P5: IC1.P5(LCD_D[8]/I2S2_CLK/GP[18]/SPI_CLK) ; port I2S2_CLK
NetIC1_P6: IC1.P6(SD0_D1/I2S0_RX/GP[3]) ; port SD0_D1
NetIC1_P7: IC1.P7(SD0_D3/GP[5]) ; port SD0_D3
NetIC1_P9: IC1.P9(LCD_D[10]/I2S2_RX/GP[20]/SPI_RX) ; port I2S2_RX
NetIC1_P10: IC1.P10(SD1_D1/I2S1_RX/GP[9]) ; port SD1_D1
NetIC1_P11: IC1.P11(LCD_D[11]/I2S2_DX/GP[27]/SPI_TX) ; port I2S2_DX
NetIC1_P12: IC1.P12(LCD_D[13]/UART_CTS/GP[29]/I2S3_FS) ; port UART_CTS
NetIC1_P13: IC1.P13(LCD_D[14]/UART_RXD/GP[30]/I2S3_RX) ; port UART_RX

Not connected (* = marked no-connect by the designer): IC1 A8(GPAIN0)* A9(GPAIN2)* A10(GPAIN3)* B8(GPAIN1)* D14(USB_MXO)* E1(RSV7)* E2(RSV11)* F1(RSV8)* G1(RSV9)* G2(RSV12)* H1(RSV10)* H14(USB_DP)* J2(LCD_D[2]/GP[12])* J14(USB_DM)* L14(USB_VBUS)* M2(LCD_CS1_E1/SPI_CS1)* M5(LCD_RS/SPI_CS3)* N2(LCD_RW_WRB/SPI_CS2)* N5(LCD_D[3]/GP[13])* N7(LCD_D[5]/GP[15])* P2(LCD_D[4]/GP[14])* P3(LCD_D[6]/GP[16])* P8(LCD_D[7]/GP[17])*

### Notes on the sheet
- USB_CLK_12MHz
- (near R27) CLK_SEL
- (near R27) CPU_CLK_12MHz
- SPI_RX
- SPI_TX
- GPIO12
- GPIO13
- GPIO14
- GPIO15
- GPIO16
- I2S2_CLK
- I2S2_FS
- GPIO17
- I2S2_RX
- I2S2_DX
- UART_RTS
- UART:CTS
- UART_RX
- (near R30) RTC_CLKOUT
- UART_TX
- SPI_CLK
- SPI_CS0
- SPI_CS1
- SPI_CS2
- SPI_CS3

### Library data of the parts
C32-C39 = Cap: Capacitor; Published: 8-Jun-2000; LatestRevisionDate: 17-Jul-2002; LatestRevisionNote: Re-released for DXP Platform.; Publisher: Altium Limited
  C32 C39: Value: 10uF
  C33 C37 C38: Value: 0.1uF
  C34: Value: 1000pF
  C35 C36: Value: 33pF
D2 = CMP-22017-000004-1: LED AMBER CLEAR SMD; Manufacturer: Lite-On; Luminous Intensity: 6mcd; Viewing Angle: 130°; Wavelength: 602nm; Reverse Voltage: 5V; Forward Current: 30mA; Led Orientation: Top View; Power Dissipation: 100mW; Peak Emmision Wavelength: 610nm; Forward Voltage: 2.1V; ComponentLink2Description: Datasheet; Device Class L3: unset; Height: 1.2mm; RoHS: TRUE; ComponentLink2URL: https://media.digikey.com/pdf/Data%20Sheets/Lite-On%20PDFs/LTST-C150AKT.pdf; Temperature: -55°C to +85°C; Package: 0; Automotive: No; Manufacturer Part Number: LTST-C150AKT; Temperature Range Low: -55°C; Device Class L2: LEDs; Device Class L1: Optoelectronics; Octopart: https://octopart.com/ltst-c150akt-lite-on-549804; Digikey Description: LED AMBER CLEAR SMD; Colour: Amber; Category: Diode; Mouser Description: Standard LEDs - SMD Amber Clear 602nm; Lead Free: Yes; Temperature Range High: +85°C
FB3 = CMP-0686-00717-3: as FB1 on sheet Codec; Contact Plating: Tin; Weight: 0.000194oz; Series: EMIFIL®, BLM21A; Core Material: Ferrite; Test Frequency: 100MHz; Case Code (Metric): 2012; Package Quantity: 4000; Lead Free: Lead Free; Max Operating Temperature: 125°C; Case Code (Imperial): 0805; Material: Ferrite; Min Operating Temperature: -55°C; Tolerance: 25%; Length: 2mm; DC Resistance-Max: 100mR; Width: 1.25mm; RoHS Compliant: Yes; Packaging: Tape and Reel; REACH SVHC: No SVHC; Depth: 1.45mm; Number of Pins: 2; Radiation Hardening: No; Current Rating: 800mA; Height: 0.85mm; Termination: SMD/SMT; Number of Lines: 1; Max DC Current: 200mA; Case/Package: 0805
IC1 = TMS320C5535AZHH10: Integrated Circuit; Manufacturer_Name: Texas Instruments; Datasheet Link: https://www.ti.com/lit/ds/symlink/tms320c5535.pdf?ts=1611725836718&ref_url=https%253A%252F%252Fwww.ti.com%252Fstore%252Fti%252Fen%252Fp%252Fproduct%252F%253Fp%253DTMS320C5535AZAY10; Height: 1.4mm; Manufacturer_Part_Number: TMS320C5535AZHH10; Mouser Part Number: 595-MS320C5535AZHH10; Mouser Price/Stock: https://www.mouser.co.uk/ProductDetail/Texas-Instruments/TMS320C5535AZHH10/?qs=bdKHSS5iKg4ejDTN3zE2OA%3D%3D; Arrow Part Number: TMS320C5535AZHH10; Arrow Price/Stock: https://www.arrow.com/en/products/tms320c5535azhh10/texas-instruments
R25-R35 = Res1: Resistor; Published: 8-Jun-2000; LatestRevisionDate: 17-Jul-2002; LatestRevisionNote: Re-released for DXP Platform.; Publisher: Altium Limited
  R25-R32: Value: 10k
  R33 R34: Value: 100k
  R35: Value: 220
Y1 = CMP-27762-003010-1: CRYSTAL 32.7680KHZ 12.5PF SMD; Series Resistance: 55kR; Tolerance: 20ppm; Max Operating Temperature: 85°C; Min Operating Temperature: -40°C; Series: ABS07L; Package Quantity: 1; Lead Free: Lead Free; Load Capacitance: 12.5pF; Packaging: Tape and Reel; Frequency: 32.768kHz; Height: 0.015inch; Number of Pins: 2; Length: 0.126inch; Width: 0.059inch; Termination: SMD/SMT; RoHS Compliant: Yes; Mount: Surface Mount; Radiation Hardening: No; Case/Package: SMD/SMT; ESR (Equivalent Series Resistance): 55kR; Frequency Tolerance: 20ppm

## Sheet XDS100_V2.SchDoc
size A4; SheetNumber: 9; SheetTotal: 9
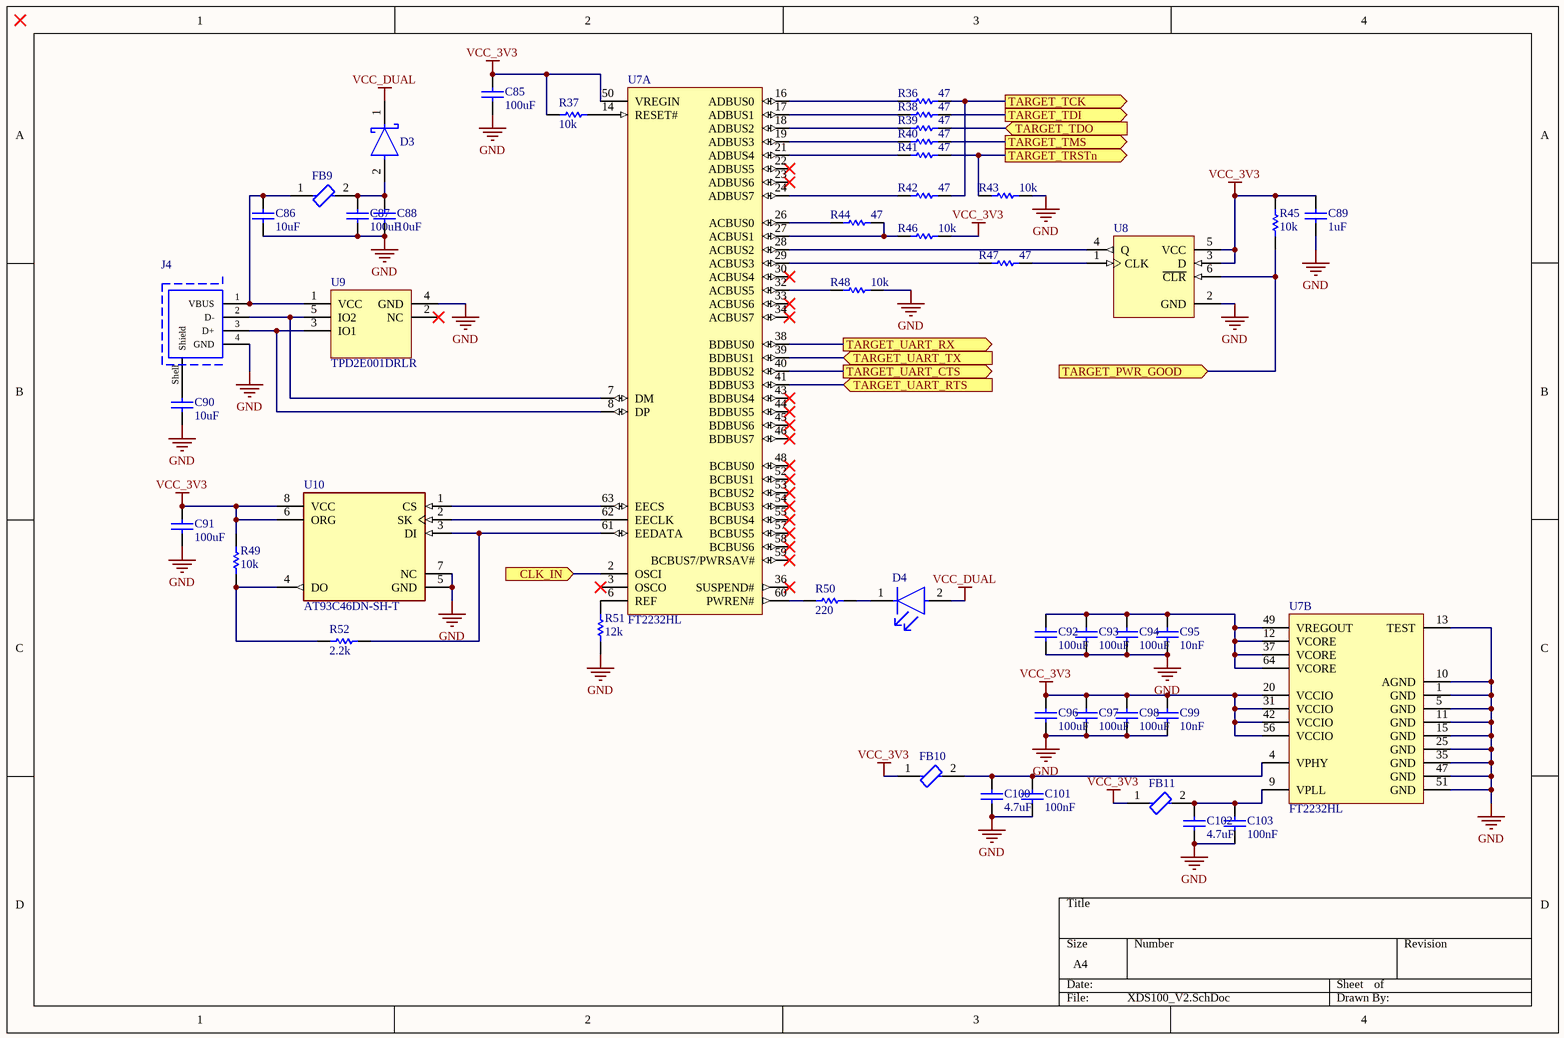
[diagram p6: XDS100_V2.SchDoc]

### Parts
C85  100uF  [0805_C_S]
C86  10uF  [0805_C_S]
C87  100uF  [0805_C_S]
C88  10uF  [0805_C_S]
C89  1uF  [0805_C_S]
C90  10uF  [0805_C_S]
C91  100uF  [0805_C_S]
C92  100uF  [0805_C_S]
C93  100uF  [0805_C_S]
C94  100uF  [0805_C_S]
C95  10nF  [0805_C_S]
C96  100uF  [0805_C_S]
C97  100uF  [0805_C_S]
C98  100uF  [0805_C_S]
C99  10nF  [0805_C_S]
C100  4.7uF  [0805_C_S]
C101  100nF  [0805_C_S]
C102  4.7uF  [0805_C_S]
C103  100nF  [0805_C_S]
D3  MBR0520LT1G  [FP-425-04-IPC_C]  (value not drawn)
D4  LTST-C150AKT  [FP-LTST-C150AKT-MFG]  (value not drawn)
FB9  BLM21PG221SN1D  [FP-BLM21-0_2-t0_85-e0_5-IPC_B]  (value not drawn)
FB10  BLM21PG221SN1D  [FP-BLM21-0_2-t0_85-e0_5-IPC_B]  (value not drawn)
FB11  BLM21PG221SN1D  [FP-BLM21-0_2-t0_85-e0_5-IPC_B]  (value not drawn)
J4  62900416021  [62900416021]  (value not drawn)
R36  47  [0805_R_S]
R37  10k  [0805_R_S]
R38  47  [0805_R_S]
R39  47  [0805_R_S]
R40  47  [0805_R_S]
R41  47  [0805_R_S]
R42  47  [0805_R_S]
R43  10k  [0805_R_S]
R44  47  [0805_R_S]
R45  10k  [0805_R_S]
R46  10k  [0805_R_S]
R47  47  [0805_R_S]
R48  10k  [0805_R_S]
R49  10k  [0805_R_S]
R50  220  [0805_R_S]
R51  12k  [0805_R_S]
R52  2.2k  [0805_R_S]
U7  FT2232HL  [FTDI-LQFP-64_L]  (parts A,B of 2)
U8  SN74LVC1G175DBVR  [DBV0006A_L]  (value not drawn)
U9  TPD2E001DRLR  [DRL0005A_L]
U10  AT93C46DN-SH-T  [FP-C04-057-SN-MFG]

### Ports
CLK_IN (in), TARGET_PWR_GOOD (in), TARGET_TCK (out), TARGET_TDI (out), TARGET_TDO (in), TARGET_TMS (out), TARGET_TRSTn (out), TARGET_UART_CTS (out), TARGET_UART_RTS (in), TARGET_UART_RX (out), TARGET_UART_TX (in)

### Nets
GND: C85.1 C86.1 C87.1 C88.1 C89.1 C90.1 C91.1 C92.1 C93.1 C94.1 C95.1 C96.1 C97.1 C98.1 C99.1 C100.1 C101.1 C102.1 C103.1 J4.4(GND) R43.2 R48.2 R51.2 U7.1(GND) U7.5(GND) U7.10(AGND) U7.11(GND) U7.13(TEST) U7.15(GND) U7.25(GND) U7.35(GND) U7.47(GND) U7.51(GND) U8.2(GND) U9.4(GND) U10.5(GND) U10.7(NC)
VCC_3V3: C85.2 C89.2 C91.2 C96.2 C97.2 C98.2 C99.2 FB10.1 FB11.1 R37.1 R45.1 R46.2 R49.1 U7.20(VCCIO) U7.31(VCCIO) U7.42(VCCIO) U7.50(VREGIN) U7.56(VCCIO) U8.3(D) U8.5(VCC) U10.6(ORG) U10.8(VCC)
VCC_DUAL: D3.1(C) D4.2(A)
CLK_12MHz: U7.2(OSCI) ; port CLK_IN
PWR_GOOD: R45.2 U8.6(~{CLR}) ; port TARGET_PWR_GOOD
NetC86_2: C86.2 FB9.1 J4.1(VBUS) U9.1(VCC)
NetC87_2: C87.2 C88.2 D3.2(A) FB9.2
NetC90_2: C90.2 J4.Shell(Shield)
NetC92_2: C92.2 C93.2 C94.2 C95.2 U7.12(VCORE) U7.37(VCORE) U7.49(VREGOUT) U7.64(VCORE)
NetC100_2: C100.2 C101.2 FB10.2 U7.4(VPHY)
NetC102_2: C102.2 C103.2 FB11.2 U7.9(VPLL)
NetD4_1: D4.1(C) R50.2
NetIC1_K2: R38.2 ; port TARGET_TDI
NetIC1_M11: U7.39(BDBUS1) ; port TARGET_UART_TX
NetIC1_N1: R39.2 ; port TARGET_TDO
NetIC1_N3: R36.2 R42.2 ; port TARGET_TCK
NetIC1_N6: R40.2 ; port TARGET_TMS
NetIC1_N12: U7.41(BDBUS3) ; port TARGET_UART_RTS
NetIC1_P4: R41.2 R43.1 ; port TARGET_TRSTn
NetIC1_P12: U7.40(BDBUS2) ; port TARGET_UART_CTS
NetIC1_P13: U7.38(BDBUS0) ; port TARGET_UART_RX
NetJ4_2: J4.2(D-) U7.7(DM) U9.5(IO2)
NetJ4_3: J4.3(D+) U7.8(DP) U9.3(IO1)
NetR36_1: R36.1 U7.16(ADBUS0)
NetR37_2: R37.2 U7.14(RESET#)
NetR38_1: R38.1 U7.17(ADBUS1)
NetR39_1: R39.1 U7.18(ADBUS2)
NetR40_1: R40.1 U7.19(ADBUS3)
NetR41_1: R41.1 U7.21(ADBUS4)
NetR42_1: R42.1 U7.24(ADBUS7)
NetR44_1: R44.1 U7.26(ACBUS0)
NetR44_2: R44.2 R46.1 U7.27(ACBUS1)
NetR47_1: R47.1 U7.29(ACBUS3)
NetR47_2: R47.2 U8.1(CLK)
NetR48_1: R48.1 U7.32(ACBUS5)
NetR49_2: R49.2 R52.1 U10.4(DO)
NetR50_1: R50.1 U7.60(PWREN#)
NetR51_1: R51.1 U7.6(REF)
NetR52_2: R52.2 U7.61(EEDATA) U10.3(DI)
NetU7_28: U7.28(ACBUS2) U8.4(Q)
NetU7_62: U7.62(EECLK) U10.2(SK)
NetU7_63: U7.63(EECS) U10.1(CS)

Not connected (* = marked no-connect by the designer): U7 3(OSCO)* 22(ADBUS5)* 23(ADBUS6)* 30(ACBUS4)* 33(ACBUS6)* 34(ACBUS7)* 36(SUSPEND#)* 43(BDBUS4)* 44(BDBUS5)* 45(BDBUS6)* 46(BDBUS7)* 48(BCBUS0)* 52(BCBUS1)* 53(BCBUS2)* 54(BCBUS3)* 55(BCBUS4)* 57(BCBUS5)* 58(BCBUS6)* 59(BCBUS7/PWRSAV#)*; U9 2(NC)*

### Library data of the parts
C85-C103 = Cap: Capacitor; Published: 8-Jun-2000; LatestRevisionDate: 17-Jul-2002; LatestRevisionNote: Re-released for DXP Platform.; Publisher: Altium Limited
  C85 C87 C91-C94 C96-C98: Value: 100uF
  C86 C88 C90: Value: 10uF
  C89: Value: 1uF
  C95 C99: Value: 10nF
  C100 C102: Value: 4.7uF
  C101 C103: Value: 100nF
D3 = CMP-1055-00425-2: DIODE SCHOTTKY 20V 500MA SOD123; Polarity: Standard; Peak Non-Repetitive Surge Current: 5.5A; Forward Voltage: 385mV; Element Configuration: Single; Peak Reverse Current: 250uA; Max Repetitive Reverse Voltage (Vrrm): 20V; Voltage Rating (DC): 20V; Case/Package: SOD-123-2; Number of Pins: 2; Output Current: 500mA; Min Operating Temperature: -65°C; Lead Free: Lead Free; REACH SVHC: No SVHC; Max Reverse Voltage (DC): 20V; Termination: SMD/SMT; Average Rectified Current: 500mA; Max Surge Current: 5.5A; Package Quantity: 3000; Height: 1.12mm; Current Rating: 500mA; Forward Current: 500mA; Max Forward Surge Current (Ifsm): 5.5A; Packaging: Tape and Reel; Length: 2.69mm; Radiation Hardening: No; Max Reverse Leakage Current: 250uA; Width: 1.6mm; Contact Plating: Tin; Max Operating Temperature: 125°C
D4 = CMP-22017-000004-1: as D2 on sheet dsp_connection; ComponentLink2Description: Datasheet; Device Class L3: unset; Height: 1.2mm; RoHS: TRUE; ComponentLink2URL: https://media.digikey.com/pdf/Data%20Sheets/Lite-On%20PDFs/LTST-C150AKT.pdf; Temperature: -55°C to +85°C; Package: 0; Automotive: No; Manufacturer Part Number: LTST-C150AKT; Temperature Range Low: -55°C; Device Class L2: LEDs; Device Class L1: Optoelectronics; Octopart: https://octopart.com/ltst-c150akt-lite-on-549804; Digikey Description: LED AMBER CLEAR SMD; Colour: Amber; Category: Diode; Mouser Description: Standard LEDs - SMD Amber Clear 602nm; Lead Free: Yes; Temperature Range High: +85°C
FB9-FB11 = CMP-0686-00610-3: Chip Ferrite Bead, 0805, 220Ω @ 100MHz, 0.045Ω, 25%, 2A; Number of Circuits: 1; Shielding: Unshielded; DC Resistance (DCR): 45mR; Impedance: 220R; Radiation Hardening: No; Material: Ferrite; Frequency: 100MHz; Width: 1.25mm; DC Current: 2A; Max DC Current: 2A; Number of Lines: 1; Package Quantity: 1; Case Code (Metric): 2012; Current Rating: 2A; Case/Package: 0805; Current: 2A; Military Standard: Not; Core Material: Ferrite; Depth: 1.25mm; Contact Plating: Tin; DC Resistance-Max: 45mR; Max Operating Temperature: 125°C; Length: 2mm; Max Current Rating: 2A; REACH SVHC: No SVHC; Termination: SMD/SMT; Min Operating Temperature: -55°C; Series: BLM21P; Test Frequency: 100MHz; Tolerance: 25%; Number of Pins: 2; RoHS Compliant: Yes; Height: 0.85mm; Packaging: Tape and Reel; Lead Free: Lead Free; Case Code (Imperial): 0805
J4 = CMP-1502-03240-1: USB 2.0 Type A Receptacle WR-COM, Horizontal, SMT; Manufacturer: Wurth Elektronik; Rated Current: 1.5A; Contact Resistance: 20mOhm; Working Voltage: 30VAC; Operating Temperature: -40to105degC; Packaging: Tray; Package Reference: 62900416021; Gender: Receptacle; Datasheet URL: https://katalog.we-online.de/em/datasheet/62900416021.pdf; Manufacturer URL: http://www.we-online.de; Part Number: 62900416021; Mounting Technology: SMT; Connector Type: USB2.0TypeA; Orientation: Horizontal; Publisher: WurthElektronik
R36-R52 = Res1: Resistor; Published: 8-Jun-2000; LatestRevisionDate: 17-Jul-2002; LatestRevisionNote: Re-released for DXP Platform.; Publisher: Altium Limited
  R36 R38-R42 R44 R47: Value: 47
  R37 R43 R45 R46 R48 R49: Value: 10k
  R50: Value: 220
  R51: Value: 12k
  R52: Value: 2.2k
U7 = CMP-2000-06287-1: Dual High Speed USB to Multipurpose UART / FIFO IC / , 3 to 3.6 V, -40 to 85 degC, 64- Pin LQFP, RoHS; Manufacturer: FTDI; Number of Channels per Chip: 2; Standard Supported: RS232,RS422,RS485; Maximum Data Rate: 480Mbit/s; Package Description: 64-Pin Low-profile Quad Flat Package, Body 10 x 10 mm, Pitch 0.5 mm; Maximum Operating Temperature: +85°C; Mounting Technology: SurfaceMount; Pin Count: 64; Package Reference: LQFP-64; Manufacturer URL: http://www.nxp.com/; Length: 10mm; Width: 10mm; Minimum Operating Temperature: -40°C; Dimensions: 10x10x1.4mm; Package Type: LQFP; Mounting Type: SurfaceMount; Datasheet URL: http://www.ftdichip.com/Support/Documents/DataSheets/ICs/DS_FT2232H.pdf; Datasheet Version: Rev. 2.5, 07/2016; Height: 1.4mm
U8 = CMP-0859-00200-3: Single D-Type Flip-Flop with Asynchronous Clear, DBV0006A, LARGE T&R; Manufacturer: Texas Instruments; VCC(Min)(V): 1.65; Output Type: CMOS; Rating: Catalog; Bits(#): 1; Schmitt Trigger: No; ICC @ Nom Voltage(Max)(mA): 0.01; Input Type: CMOS/TTL; tpd @ Nom Voltage(Max)(ns): 13.4,7.1,5.7,4; Technology Family: LVC; Logic: True; Voltage(Nom)(V): 1.8,2.5,3.3,5; Output Drive (IOL/IOH)(Max)(mA): 32/-32; F @ Nom Voltage(Max)(Mhz): 150; VCC(Max)(V): 5.5; Operating Temperature Range(C): -40 to 125,-40 to 85; 3-State Output: No; Sub-Family: D-Type Flip-Flop; PackageReference: DBV0006A; Generic Part Number: SN74LVC1G175; DatasheetVersion: SCES560F
U9 = CMP-0326-00048-3: Low-Capacitance + / - 15 kV ESD-Protection Array for High-Speed Data Interfaces, 2 Channels, -40 to +85 degC, 5-pin SOT (DRL), Green (RoHS & no Sb/Br); Manufacturer: Texas Instruments; IO Leakage Current(nA): 1; IEC 61000-4-2 Air-Gap(+/- kV): 15; IEC 61000-4-2 Contact(+/- kV): 8; SubFamily: ESD Solution; IO Capacitance(Typ)(pF): 1.5; Breakdown Voltage(Min)(V): 11; USB High Speed: TRUE; ComponentLink3Description: URL Link1; PackageReference: DRL0005A; PartNumber: TPD2E001DRLR; PackageDescription: 5-Pin Plastic Small Outline, Flat Lead 0.5 mm Pitch; PackageVersion: revD, Aug-2007; DatasheetVersion: SLLS684F; ComponentLink1Description: Manufacturer URL; ComponentLink2Description: Datasheet; ComponentLink1URL: http://www.ti.com/; ComponentLink2URL: http://www.ti.com/general/docs/lit/getliterature.tsp?genericPartNumber=TPD2E001&fileType=pdf; ComponentLink3URL: SamplesURL:http://www.ti.com/product/tpd2e001#samples; Eco-Plan: Green (RoHS & no Sb/Br); Mounting Technology: Surface Mount
U10 = CMP-06313-000016-1: IC EEPROM 1K SPI 2MHZ 8SOIC; Manufacturer: Microchip; Nominal Supply Current: 0.5mA; Memory Size: 1Kbits; Access Time: 1000ns; Max Supply Voltage: 5.5V; Interface: Other; Standoff Height: 0.1mm; Min Supply Voltage: 1.8V; Category: IC; Temperature Range High: +85°C; Mouser Description: EEPROM Serial-3Wire 1K-Bit 128 x 8/64 x 16 2.5V/3.3V/5V 8-Pin SOIC T/R; Ipc Land Pattern Name: SOIC127P600X175-8; Temperature Range Low: -40°C; Temperature: -40°C to +85°C; Digikey Description: IC EEPROM 1K SPI 2MHZ 8SOIC; Lead Free: Yes; Device Class L2: Memory; ComponentLink2URL: http://ww1.microchip.com/downloads/en/DeviceDoc/20006224B.pdf; Automotive: No; Device Class L3: EEPROM; Package: C04-057-SN; Octopart: https://octopart.com/at93c46dn-sh-t-microchip-77759177; RoHS: TRUE; Memory Type: EEPROM; Height: 1.75mm; Manufacturer Part Number: AT93C46DN-SH-T; ComponentLink2Description: Datasheet; Frequency: 2MHz; Device Class L1: Integrated Circuits (ICs)

## Sheet dsp_power.SchDoc
size A4; SheetNumber: 7; SheetTotal: 10
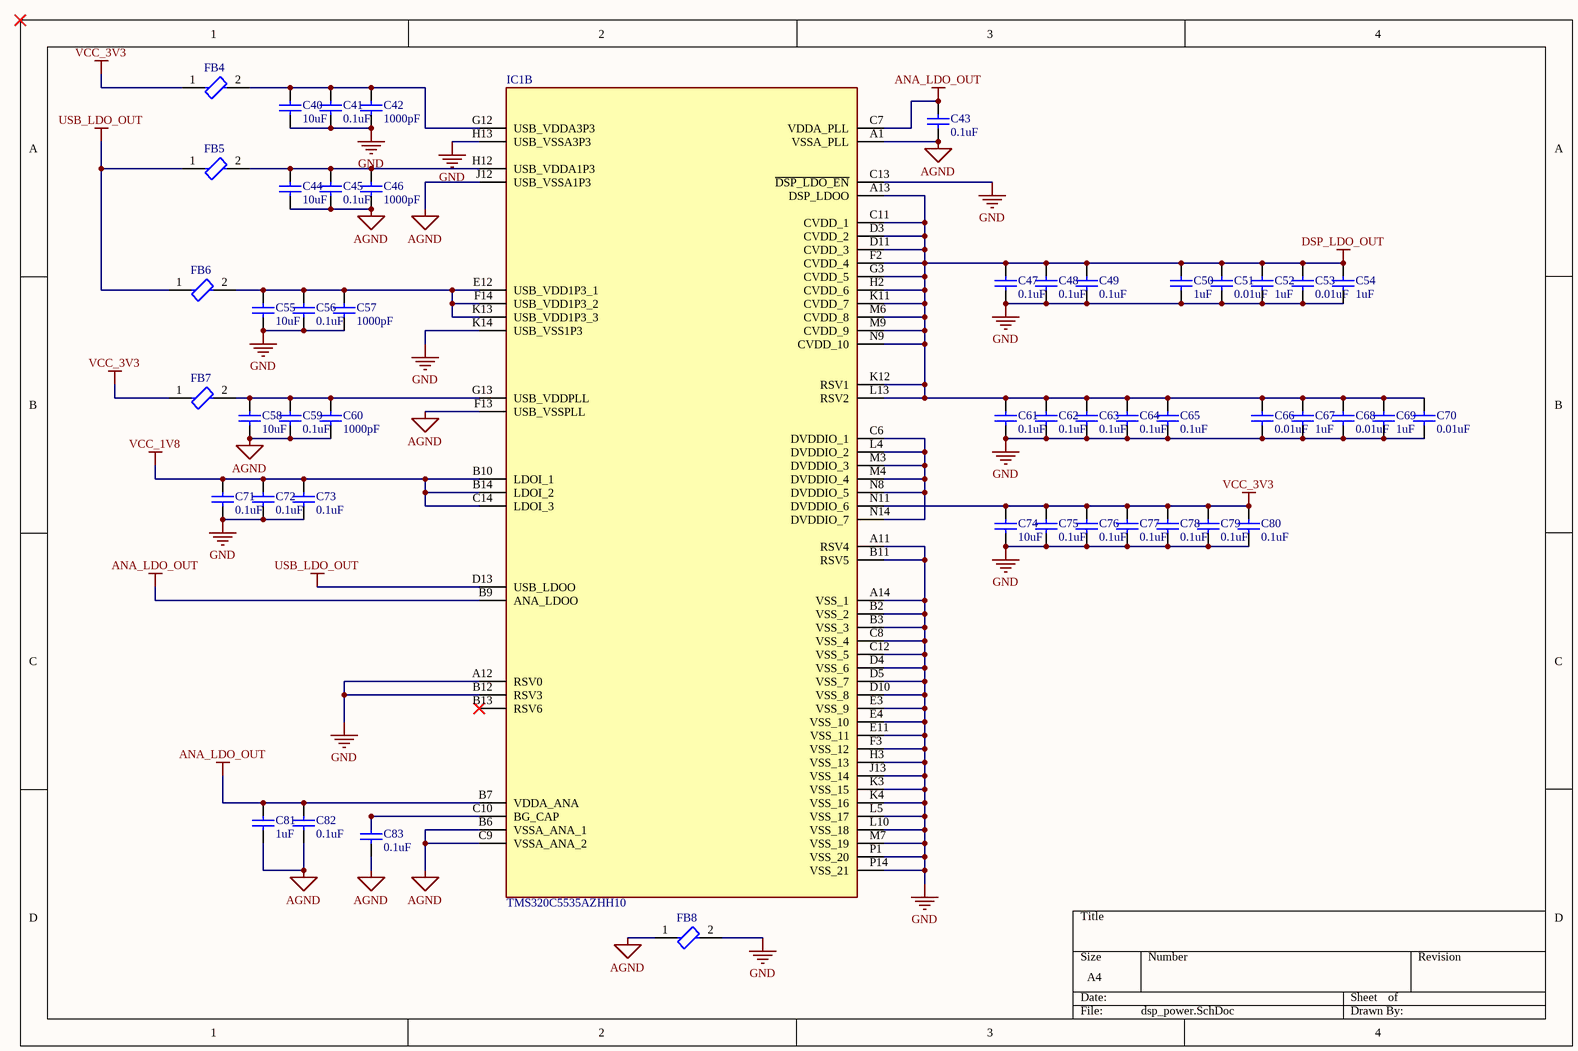
[diagram p7: dsp_power.SchDoc]

### Parts
C40  10uF  [0805_C_S]
C41  0.1uF  [0805_C_S]
C42  1000pF  [0805_C_S]
C43  0.1uF  [0805_C_S]
C44  10uF  [0805_C_S]
C45  0.1uF  [0805_C_S]
C46  1000pF  [0805_C_S]
C47  0.1uF  [0805_C_S]
C48  0.1uF  [0805_C_S]
C49  0.1uF  [0805_C_S]
C50  1uF  [0805_C_S]
C51  0.01uF  [0805_C_S]
C52  1uF  [0805_C_S]
C53  0.01uF  [0805_C_S]
C54  1uF  [0805_C_S]
C55  10uF  [0805_C_S]
C56  0.1uF  [0805_C_S]
C57  1000pF  [0805_C_S]
C58  10uF  [0805_C_S]
C59  0.1uF  [0805_C_S]
C60  1000pF  [0805_C_S]
C61  0.1uF  [0805_C_S]
C62  0.1uF  [0805_C_S]
C63  0.1uF  [0805_C_S]
C64  0.1uF  [0805_C_S]
C65  0.1uF  [0805_C_S]
C66  0.01uF  [0805_C_S]
C67  1uF  [0805_C_S]
C68  0.01uF  [0805_C_S]
C69  1uF  [0805_C_S]
C70  0.01uF  [0805_C_S]
C71  0.1uF  [0805_C_S]
C72  0.1uF  [0805_C_S]
C73  0.1uF  [0805_C_S]
C74  10uF  [0805_C_S]
C75  0.1uF  [0805_C_S]
C76  0.1uF  [0805_C_S]
C77  0.1uF  [0805_C_S]
C78  0.1uF  [0805_C_S]
C79  0.1uF  [0805_C_S]
C80  0.1uF  [0805_C_S]
C81  1uF  [0805_C_S]
C82  0.1uF  [0805_C_S]
C83  0.1uF  [0805_C_S]
FB4  BLM21AG151SN1D  [FP-BLM21-0_2-t0_85-e0_5-MFG]  (value not drawn)
FB5  BLM21AG151SN1D  [FP-BLM21-0_2-t0_85-e0_5-MFG]  (value not drawn)
FB6  BLM21AG151SN1D  [FP-BLM21-0_2-t0_85-e0_5-MFG]  (value not drawn)
FB7  BLM21AG151SN1D  [FP-BLM21-0_2-t0_85-e0_5-MFG]  (value not drawn)
FB8  BLM21AG151SN1D  [FP-BLM21-0_2-t0_85-e0_5-MFG]  (value not drawn)
IC1  TMS320C5535AZHH10  [BGA144C80P14X14_1200X1200X140]  (part B of 2)

### Nets
AGND: C43.1 C44.1 C45.1 C46.1 C58.1 C59.1 C60.1 C81.1 C82.1 C83.1 FB8.1 IC1.A1(VSSA_PLL) IC1.B6(VSSA_ANA_1) IC1.C9(VSSA_ANA_2) IC1.F13(USB_VSSPLL) IC1.J12(USB_VSSA1P3)
ANA_LDO_OUT: C43.2 C81.2 C82.2 IC1.B7(VDDA_ANA) IC1.B9(ANA_LDOO) IC1.C7(VDDA_PLL)
DSP_LDO_OUT: C47.2 C48.2 C49.2 C50.2 C51.2 C52.2 C53.2 C54.2 C61.2 C62.2 C63.2 C64.2 C65.2 C66.2 C67.2 C68.2 C69.2 C70.2 IC1.A13(DSP_LDOO) IC1.C11(CVDD_1) IC1.D3(CVDD_2) IC1.D11(CVDD_3) IC1.F2(CVDD_4) IC1.G3(CVDD_5) IC1.H2(CVDD_6) IC1.K11(CVDD_7) IC1.K12(RSV1) IC1.L13(RSV2) IC1.M6(CVDD_8) IC1.M9(CVDD_9) IC1.N9(CVDD_10)
GND: C40.1 C41.1 C42.1 C47.1 C48.1 C49.1 C50.1 C51.1 C52.1 C53.1 C54.1 C55.1 C56.1 C57.1 C61.1 C62.1 C63.1 C64.1 C65.1 C66.1 C67.1 C68.1 C69.1 C70.1 C71.1 C72.1 C73.1 C74.1 C75.1 C76.1 C77.1 C78.1 C79.1 C80.1 FB8.2 IC1.A11(RSV4) IC1.A12(RSV0) IC1.A14(VSS_1) IC1.B2(VSS_2) IC1.B3(VSS_3) IC1.B11(RSV5) IC1.B12(RSV3) IC1.C8(VSS_4) IC1.C12(VSS_5) IC1.C13(~{DSP_LDO_EN}) IC1.D4(VSS_6) IC1.D5(VSS_7) IC1.D10(VSS_8) IC1.E3(VSS_9) IC1.E4(VSS_10) IC1.E11(VSS_11) IC1.F3(VSS_12) IC1.H3(VSS_13) IC1.H13(USB_VSSA3P3) IC1.J13(VSS_14) IC1.K3(VSS_15) IC1.K4(VSS_16) IC1.K14(USB_VSS1P3) IC1.L5(VSS_17) IC1.L10(VSS_18) IC1.M7(VSS_19) IC1.P1(VSS_20) IC1.P14(VSS_21)
USB_LDO_OUT: FB5.1 FB6.1 IC1.D13(USB_LDOO)
VCC_1V8: C71.2 C72.2 C73.2 IC1.B10(LDOI_1) IC1.B14(LDOI_2) IC1.C14(LDOI_3)
VCC_3V3: C74.2 C75.2 C76.2 C77.2 C78.2 C79.2 C80.2 FB4.1 FB7.1 IC1.N11(DVDDIO_6)
NetC40_2: C40.2 C41.2 C42.2 FB4.2 IC1.G12(USB_VDDA3P3)
NetC44_2: C44.2 C45.2 C46.2 FB5.2 IC1.H12(USB_VDDA1P3)
NetC55_2: C55.2 C56.2 C57.2 FB6.2 IC1.E12(USB_VDD1P3_1) IC1.F14(USB_VDD1P3_2) IC1.K13(USB_VDD1P3_3)
NetC58_2: C58.2 C59.2 C60.2 FB7.2 IC1.G13(USB_VDDPLL)
NetC83_2: C83.2 IC1.C10(BG_CAP)
NetIC1_C6: IC1.C6(DVDDIO_1) IC1.L4(DVDDIO_2) IC1.M3(DVDDIO_3) IC1.M4(DVDDIO_4) IC1.N8(DVDDIO_5) IC1.N14(DVDDIO_7)

Not connected (* = marked no-connect by the designer): IC1 B13(RSV6)*

### Library data of the parts
C40-C83 = Cap: Capacitor; Published: 8-Jun-2000; LatestRevisionDate: 17-Jul-2002; LatestRevisionNote: Re-released for DXP Platform.; Publisher: Altium Limited
  C40 C44 C55 C58 C74: Value: 10uF
  C41 C43 C45 C47-C49 C56 C59 C61-C65 C71-C73 C75-C80 C82 C83: Value: 0.1uF
  C42 C46 C57 C60: Value: 1000pF
  C50 C52 C54 C67 C69 C81: Value: 1uF
  C51 C53 C66 C68 C70: Value: 0.01uF
FB4-FB8 = CMP-0686-00717-3: as FB1 on sheet Codec; Contact Plating: Tin; Weight: 0.000194oz; Series: EMIFIL®, BLM21A; Core Material: Ferrite; Test Frequency: 100MHz; Case Code (Metric): 2012; Package Quantity: 4000; Lead Free: Lead Free; Max Operating Temperature: 125°C; Case Code (Imperial): 0805; Material: Ferrite; Min Operating Temperature: -55°C; Tolerance: 25%; Length: 2mm; DC Resistance-Max: 100mR; Width: 1.25mm; RoHS Compliant: Yes; Packaging: Tape and Reel; REACH SVHC: No SVHC; Depth: 1.45mm; Number of Pins: 2; Radiation Hardening: No; Current Rating: 800mA; Height: 0.85mm; Termination: SMD/SMT; Number of Lines: 1; Max DC Current: 200mA; Case/Package: 0805
IC1 = TMS320C5535AZHH10: as IC1 on sheet dsp_connection; Datasheet Link: https://www.ti.com/lit/ds/symlink/tms320c5535.pdf?ts=1611725836718&ref_url=https%253A%252F%252Fwww.ti.com%252Fstore%252Fti%252Fen%252Fp%252Fproduct%252F%253Fp%253DTMS320C5535AZAY10; Height: 1.4mm; Manufacturer_Part_Number: TMS320C5535AZHH10; Mouser Part Number: 595-MS320C5535AZHH10; Mouser Price/Stock: https://www.mouser.co.uk/ProductDetail/Texas-Instruments/TMS320C5535AZHH10/?qs=bdKHSS5iKg4ejDTN3zE2OA%3D%3D; Arrow Part Number: TMS320C5535AZHH10; Arrow Price/Stock: https://www.arrow.com/en/products/tms320c5535azhh10/texas-instruments